# Altium schematic sheet pomiar_ph_cieczy_schemat.SchDoc
size A4
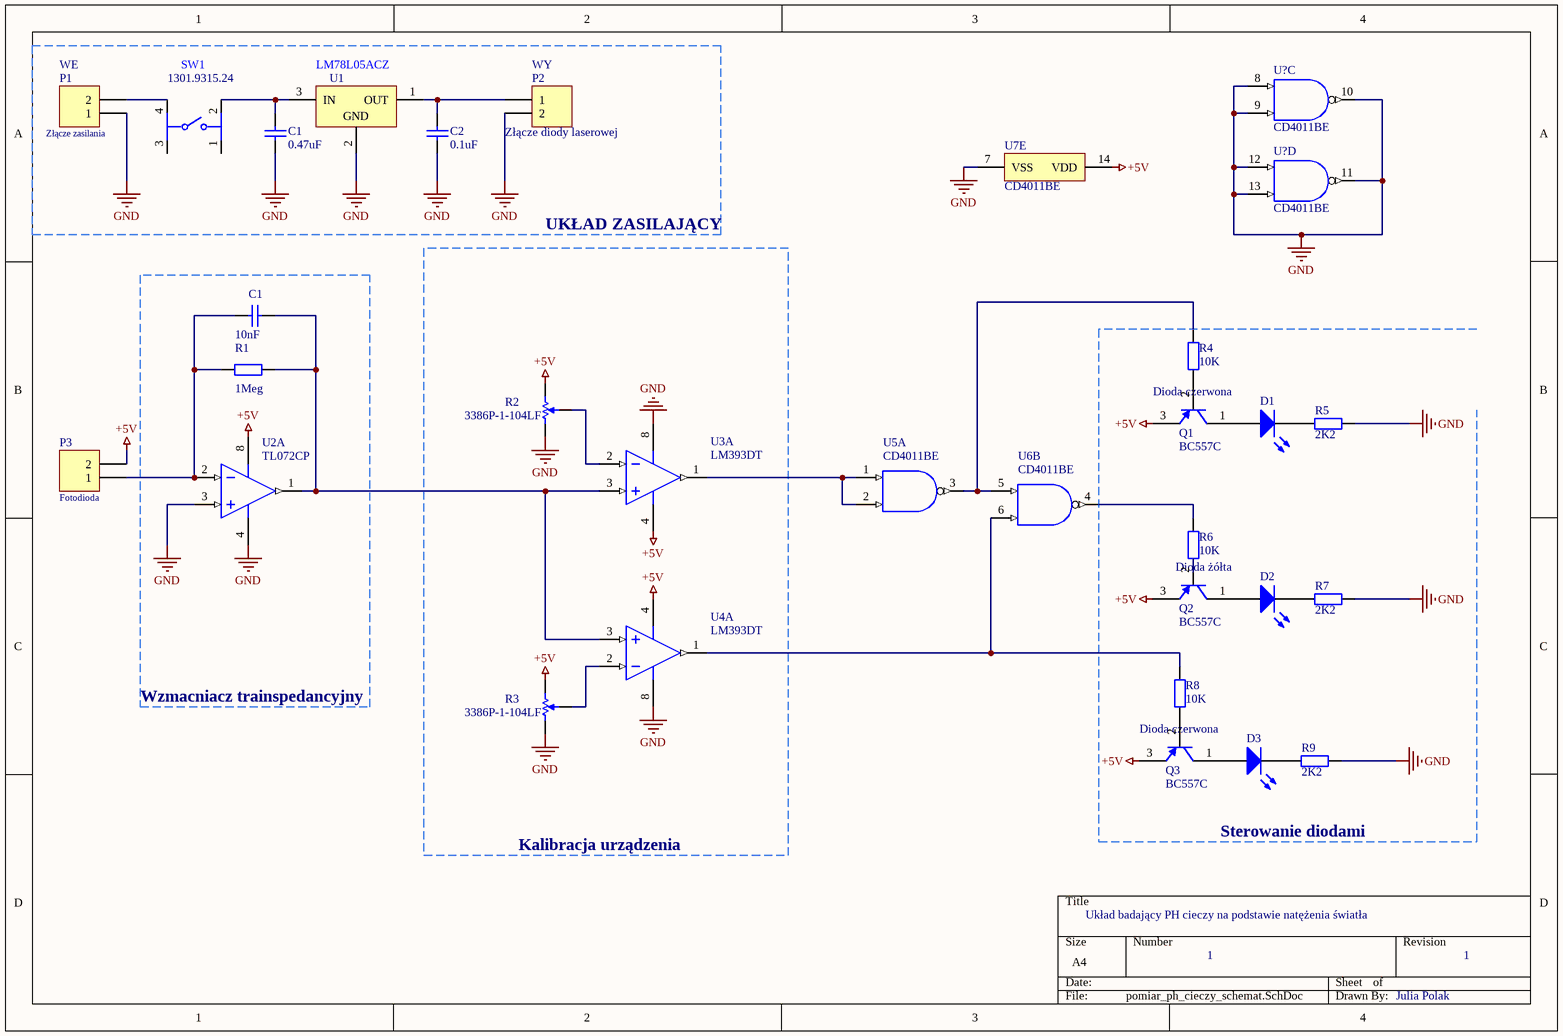
[diagram p0: pomiar_ph_cieczy_schemat.SchDoc]

## Parts
(Parts that share a designator on the sheet are numbered #1, #2 ... from top to bottom, then left to right.)
?  LM78L05ACZ  [Z03A]
C1#1  value 0.47uF  [RAD-0.3]  (hidden comment: Cap)
C1#2  value 10nF  [RAD-0.3]  (hidden comment: Cap)
C2  value 0.1uF  [RAD-0.3]  (hidden comment: Cap)
D1  LED2  [3.2X1.6X1.1]  (value not drawn)
D2  LED2  [3.2X1.6X1.1]  (value not drawn)
D3  LED2  [3.2X1.6X1.1]  (value not drawn)
P1  Złącze zasilania  [HDR1X2]
P2  Złącze diody laserowej  [HDR1X2]
P3  Fotodioda  [HDR1X2]
Q1  BC557C  [ONSC-TO-92-3-29-11]
Q2  BC557C  [ONSC-TO-92-3-29-11]
Q3  BC557C  [ONSC-TO-92-3-29-11]
R1  value 1Meg  [AXIAL-0.4]  (hidden comment: Res2)
R2  3386P-1-104LF  [BOUR-3386P]
R3  3386P-1-104LF  [BOUR-3386P]
R4  value 10K  [AXIAL-0.4]  (hidden comment: Res2)
R5  value 2K2  [AXIAL-0.4]  (hidden comment: Res2)
R6  value 10K  [AXIAL-0.4]  (hidden comment: Res2)
R7  value 2K2  [AXIAL-0.4]  (hidden comment: Res2)
R8  value 10K  [AXIAL-0.4]  (hidden comment: Res2)
R9  value 2K2  [AXIAL-0.4]  (hidden comment: Res2)
SW1  1301.9315.24  [FP-1301_9315_24-MFG]
U2  TL072CP  [P0008A]  (part A of 2)
U3  LM393DT  [STM-SO-8_D_L]  (part A of 2)
U4  LM393DT  [STM-SO-8_D_L]  (part A of 2)
U5  CD4011BE  [N0014A]  (part A of 5)
U6  CD4011BE  [N0014A]  (part B of 5)
U7  CD4011BE  [N0014A]  (part E of 5)
U?#1  CD4011BE  [N0014A]  (part C of 5)
U?#2  CD4011BE  [N0014A]  (part D of 5)

## Blocks framed on the sheet
UKŁAD ZASILAJĄCY: ? C1#1 C2 P1 P2 SW1
Wzmacniacz trainspedancyjny: C1#2 R1 U2
Kalibracja urządzenia: R2 R3 U3 U4

## Nets
+5V: P3.2 Q1.3(E) Q2.3(E) Q3.3(E) R2.3 R3.3 U2.8(VCC+) U3.4(VCC-) U4.4(VCC-) U7.14(VDD)
GND: ?.2(GND) C1#1.1 C2.1 P1.1 P2.2 R2.1 R3.1 R5.1 R7.1 R9.1 U2.3(IN1+) U2.4(VCC-) U3.8(VCC+) U4.8(VCC+) U7.7(VSS) U?#1.8(E) U?#1.9(F) U?#1.10(L) U?#2.11(M) U?#2.12(G) U?#2.13(H)
Net?_1: ?.1(OUT) C2.2 P2.1
Net?_3: ?.3(IN) C1#1.2 SW1.2
NetC1#2_1: C1#2.1 P3.1 R1.1 U2.2(IN1-)
NetC1#2_2: C1#2.2 R1.2 U2.1(OUT1) U3.3(IN1+) U4.3(IN1+)
NetD1_1: D1.1(A) Q1.1(C)
NetD1_2: D1.2(K) R5.2
NetD2_1: D2.1(A) Q2.1(C)
NetD2_2: D2.2(K) R7.2
NetD3_1: D3.1(A) Q3.1(C)
NetD3_2: D3.2(K) R9.2
NetP1_2: P1.2 SW1.4
NetQ1_2: Q1.2(B) R4.1
NetQ2_2: Q2.2(B) R6.1
NetQ3_2: Q3.2(B) R8.1
NetR2_2: R2.2 U3.2(IN1-)
NetR3_2: R3.2 U4.2(IN1-)
NetR4_2: R4.2 U5.3(J) U6.5(C)
NetR6_2: R6.2 U6.4(K)
NetR8_2: R8.2 U4.1(OUT1) U6.6(D)
NetU3_1: U3.1(OUT1) U5.1(A) U5.2(B)

Not connected (* = marked no-connect by the designer): SW1 1 3

## Notes on the sheet
- (near P1) WE
- U1
- (near P2) WY
- Dioda czerwona
- Dioda żółta
- Sterowanie diodami
- Układ badający PH cieczy na podstawie natężenia światła
- 1
- Julia Polak

## Library data of the parts
? = CMP-0062-00042-2: 3-Terminal Positive Regulators, 3-pin TO-92; Manufacturer: National Semiconductor; PackageTopMarking: NSXYTT*LM78L*05ACZ; PowerWise: N; CompType: LDO IC; PackageVersion: revG, Sep-2000; ComponentLink3Description: Z03A Package Page; ComponentLink2Description: LM78L05 Web Page; PackageDescription: TO-92, Molded, 3 Lead; RoHS: N; RevisionNote: Component URLs added; PackageReference: Z03A; ComponentLink1URL: http://www.national.com/ds/LM/LM78L05.pdf; Code_JEDEC: TO-226-AA; ComponentLink1Description: LM78L05 Datasheet; PinCount: 3; ComponentLink2URL: http://www.national.com/pf/LM/LM78L05.html; ComponentLink3URL: http://www.national.com/packaging/folders/z03a.html; DatasheetVersion: Apr-2006
C1#1 C1#2 C2 = Cap: Capacitor; Published: 8-Jun-2000; LatestRevisionDate: 17-Jul-2002; LatestRevisionNote: Re-released for DXP Platform.; PackageReference: RAD-0.3; Publisher: Altium Limited; PackageDescription: Radial Cap, Thru-Hole; 2 Leads; 0.3 in Pin Spacing
D1-D3 = LED2: Typical RED, GREEN, YELLOW, AMBER GaAs LED; Published: 8-Jun-2000; LatestRevisionDate: 17-Jul-2002; LatestRevisionNote: Re-released for DXP Platform.; PackageVersion: Feb-2002; PackageReference: 3.2X1.6X1.1; Publisher: Altium Limited; PackageDescription: SM LED; 2 Flat Leads
P1-P3 = Header 2: Header, 2-Pin; LatestRevisionDate: 17-Jul-2002; LatestRevisionNote: Re-released for DXP Platform.; Publisher: Altium Limited
Q1-Q3 = CMP-1048-01449-1: Amplifier Transistor, PNP Silicon, 3-Pin TO-92, Bulk Box; Manufacturer: On Semiconductor; IC Continuous (A): -0.1; Polarity: PNP; PartNumber: BC557C; PackageVersion: Rev. AM; RoHS: FALSE; PackageDescription: 3-Pin Transistor Outline, Body 4.825 x 3.685 mm, Pitch 1.27 mm; Packing: Bulk Box; ComponentLink2Description: Datasheet; DatasheetVersion: Rev. 3; ComponentLink3Description: Package Specification; Mounting Technology: Through Hole; ComponentLink2URL: http://www.onsemi.com/pub_link/Collateral/BC556B-D.PDF; ComponentLink1URL: http://www.onsemi.com/; ComponentLink1Description: Manufacturer URL; ComponentLink3URL: http://www.onsemi.cn/pub_link/Collateral/2N6426-D.PDF; PackageReference: TO-92-3-29-11_AM_SL
R1 R4-R9 = Res2: Resistor; Published: 8-Jun-2000; LatestRevisionDate: 17-Jul-2002; LatestRevisionNote: Re-released for DXP Platform.; PackageReference: AXIAL-0.4; Publisher: Altium Limited; PackageDescription: Axial Device, Thru-Hole; 2 Leads; 0.4 in Pin Spacing
R2 R3 = CMP-2000-05592-1: Square Trimpot(R) Trimming Potentiometer, 100 KOhm, +/- 10%, 0.5 W, -55 to 125 degC, 3-Pin THD, RoHS, Tube; Manufacturer Series: 3386; Manufacturer: Bourns; Resistive Element Material: Cermet; Shaft Diameter: 3.15mm; Number of Turns: 1; Product Height: 4.83mm; Temperature Coefficient: 100ppm/C; Product Depth: 9.53mm; Rated Temperature (Cel): 85; Actuator Orientation: Vertical; Resistance (ohm): 100000; Power Rating: 1/2W; Tolerance (%): 10; Rated Power Dissipation (P) (W): 0.5; Resistance Law: Linear; Actuator Type: Screw; Operating Temperature-Min (Cel): -55; Manufacturer URL: http://www.bourns.com/; Terminal Finish: TINLEAD; Datasheet Version: 05/2016; Tolerance: 10%; Lead Free: NO; Family: 3386; Product Length: 9.53mm; Mounting: ThroughHole; Packaging: Tube; Package: RectangularPackage; Mounting Feature: ThroughHole; Number of Terminals: 3; Minimum Operating Temperature: -55C; Mounting Technology: ThroughHole; Package Reference: 3386P; Maximum Operating Temperature: 125C; Termination Style: Pin; Datasheet URL: http://www.bourns.com/docs/Product-Datasheets/3386.pdf; Package Description: 3-Pin Through Hole Device, Body 9.53 x 9.53 mm, Pitch 2.54 mm; Product Type: Potentiometer; Operating Temperature-Max (Cel): 125; Resistance Value: 100KOhm; Terminal Shape: WIRE; Technology: Cermet; Type: Trimmer
SW1 = CMP-26321-000002-1: SWITCH TACTILE SPST-NO 0.05A 12V; Illumination Type: Illuminated; Mechanical Life: 100000Cycles; Actuator Type: Standard; Throw Configuration: SPST; Current Rating: 50mA; Switch Function: Off-Mom; Operating Force: 1.6N; Ratings: IP40; Switch Travel: 0.25mm; Max Voltage Rating (DC): 12V; Length: 6mm; REACH SVHC: No SVHC; Contact Plating: Silver; Package Quantity: 1000; Radiation Hardening: No; Packaging: Tape and Reel; RoHS Compliant: Yes; Orientation: Straight; Mount: Surface Mount; Depth: 10mm; Voltage Rating (AC): 12V; Termination: Gull Wing; Max Operating Temperature: 70°C; Case/Package: SMD/SMT; Voltage Rating (DC): 12V; Min Operating Temperature: -20°C; Series: LSH; Max Current Rating: 50mA
U2 = CMP-0017-00950-2: Dual Low-Noise JFET-Input General-Purpose Operational Amplifier, 7 to 36 V, 0 to 70 degC, 8-pin DIP (P8), Pb-Free (RoHS); Manufacturer: Texas Instruments; Sub Family: General Purpose Amplifier, High Supply Voltage Amplifier (>=30V); Total Supply Voltage(Max)(+5V is 5, +/-5V is 10): 36; Slew Rate(Typ)(V/us): 13; Vn at 1kHz(Typ)(nV/rtHz): 18; GBW(Typ)(MHz): 3; CMRR(Min)(dB): 70; Total Supply Voltage(Min)(+5V is 5, +/-5V is 10): 7; Vio (25C)(Max)(mV): 10; Rating: Catalog; IIB(Max)(pA): 200; Iq per channel(Max)(mA): 2.5; Number of Channels: 2; Mounting Technology: Through Hole; ComponentLink3Description: Package Specification; PartNumber: TL072CP; PackageVersion: 4040082/E, 04/2010; Eco-Plan: Pb-Free (RoHS); DatasheetVersion: SLOS080J; Offset Drift(Typ)(uV/C): 18; ComponentLink3URL: http://www.ti.com/litv/pdf/mpdi001b; PackageDescription: 8-Pin Plastic In-Line, Body 9.59 x 6.35 mm, Pitch 2.54 mm; Code_JEDEC: MS-001; ComponentLink2URL: http://www.ti.com/lit/ds/symlink/tl072.pdf; ComponentLink1Description: Manufacturer URL; ComponentLink2Description: Datasheet; ComponentLink1URL: http://www.ti.com/; PackageReference: P0008A
U3 U4 = CMP-2000-06550-1: Low-Power, Dual-Voltage Comparator, 2 to 36 V, 0 to 70 degC, 8-Pin SOIC (SO), RoHS, Tape and Reel; Manufacturer: STMicroelectronics; Voltage - Supply, Single/Dual (±): 2V~36V,±1V~18V; Current - Input Bias (Max): 0.25µA@5V; Number of Elements: 2; Current - Output (Typ): 18mA@5V; Other Names: 497-1593-2; Voltage - Input Offset (Max): 5mV@30V; Output Type: CMOS,DTL,ECL,MOS,Open-Collector,TTL; EDA / CAD Models: DownloadfromAcceleratedDesigns; Other Related Documents: LM393ViewAllSpecificationsLM393ViewAllSpecifications; Online Catalog: Comparators-2elements; Current - Quiescent (Max): 2.5mA; Standard Package: 2,500; Manufacturer URL: http://www.st.com/; Package Description: 8-Pin Small Outline Integrated Circuit, Body 4.9 x 3.9 mm, Pitch 1.27 mm; Packaging: Tape&Reel(TR); Datasheet Version: Rev. 15, 02/2016; Category: IntegratedCircuits(ICs); Operating Temperature: 0°C~70°C; Mounting Type: SurfaceMount; Supplier Device Package: 8-SO; Datasheet URL: http://www.st.com/content/ccc/resource/technical/document/datasheet/group1/b4/cc/cf/13/18/28/44/f5/CD00000465/files/CD00000465.pdf/jcr:content/translations/en.CD00000465.pdf; Family: Linear-Comparators; Mounting Technology: SurfaceMount; Type: GeneralPurpose; Package Reference: SO-8; Package / Case: 8-SOIC(0.154",3.90mmWidth)
U5-U7 U?#1 U?#2 = CMP-1627-00488-2: CMOS Quad 2-Input NAND Gate, N0014A, TUBE; Manufacturer: Texas Instruments; Schmitt Trigger: No; Bits(#): 4; Voltage(Nom)(V): 10; Output Drive (IOL/IOH)(Max)(mA): 1.5/-1.5; ICC @ Nom Voltage(Max)(mA): 0.015; Technology Family: CD4000; VCC(Max)(V): 18; Rating: Military; VCC(Min)(V): 3; F @ Nom Voltage(Max)(Mhz): 8; Output Type: CMOS; Input Type: CMOS; PackageReference: N0014A; Code_JEDEC: MS-001; Operating Temperature Range(C): -55 to 125; Generic Part Number: CD4011B; DatasheetVersion: SCHS021D